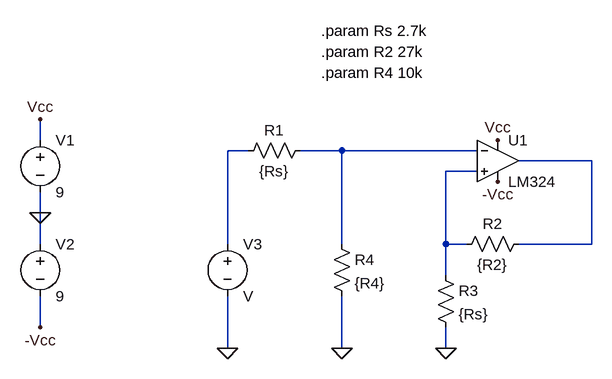
[diagram p0: schematic No_inversor.asc]
No_inversor.asc, the LTspice schematic file:
Version 4
SHEET 1 944 680
WIRE 16 48 16 16
WIRE 336 64 304 64
WIRE 480 64 416 64
WIRE 688 64 480 64
WIRE 864 80 752 80
WIRE 688 96 640 96
WIRE 16 160 16 128
WIRE 16 208 16 160
WIRE 304 208 304 64
WIRE 480 208 480 64
WIRE 640 208 640 96
WIRE 672 208 640 208
WIRE 864 208 864 80
WIRE 864 208 752 208
WIRE 640 256 640 208
WIRE 16 336 16 288
WIRE 304 368 304 288
WIRE 480 368 480 288
WIRE 640 368 640 336
FLAG 16 16 Vcc
FLAG 16 336 -Vcc
FLAG 16 160 0
FLAG 720 48 Vcc
FLAG 720 112 -Vcc
FLAG 304 368 0
FLAG 480 368 0
FLAG 640 368 0
SYMBOL sympropio\\LM324 720 16 R0
SYMATTR InstName U1
SYMBOL voltage 16 32 R0
WINDOW 123 0 0 Left 0
WINDOW 39 0 0 Left 0
SYMATTR InstName V1
SYMATTR Value 9
SYMBOL voltage 16 192 R0
WINDOW 123 0 0 Left 0
WINDOW 39 0 0 Left 0
SYMATTR InstName V2
SYMATTR Value 9
SYMBOL voltage 304 192 R0
SYMATTR InstName V3
SYMBOL res 432 48 R90
WINDOW 0 0 56 VBottom 2
WINDOW 3 32 56 VTop 2
SYMATTR InstName R1
SYMATTR Value {Rs}
SYMBOL res 464 192 R0
SYMATTR InstName R4
SYMATTR Value {R4}
SYMBOL res 624 240 R0
SYMATTR InstName R3
SYMATTR Value {Rs}
SYMBOL res 768 192 R90
WINDOW 0 0 56 VBottom 2
WINDOW 3 32 56 VTop 2
SYMATTR InstName R2
SYMATTR Value {R2}
TEXT 448 -120 Left 2 !.param Rs 2.7k
TEXT 448 -88 Left 2 !.param R2 27k
TEXT 448 -56 Left 2 !.param R4 10k

The netlist it stands for:
* No_inversor.asc
* U1: LM324 (symbol sympropio\LM324 not available, pins judged from their places): In+=N004 In-=N002 V+=Vcc V-=-Vcc OUT=N003
V1 Vcc 0 9
V2 0 -Vcc 9
V3 N001 0 V
R1 N002 N001 {Rs}
R4 N002 0 {R4}
R3 N004 0 {Rs}
R2 N003 N004 {R2}
.param Rs 2.7k
.param R2 27k
.param R4 10k
.backanno
.end